# Altium schematic sheet Power input monitoring.SchDoc
size A4; SheetNumber: 18; SheetTotal: 18
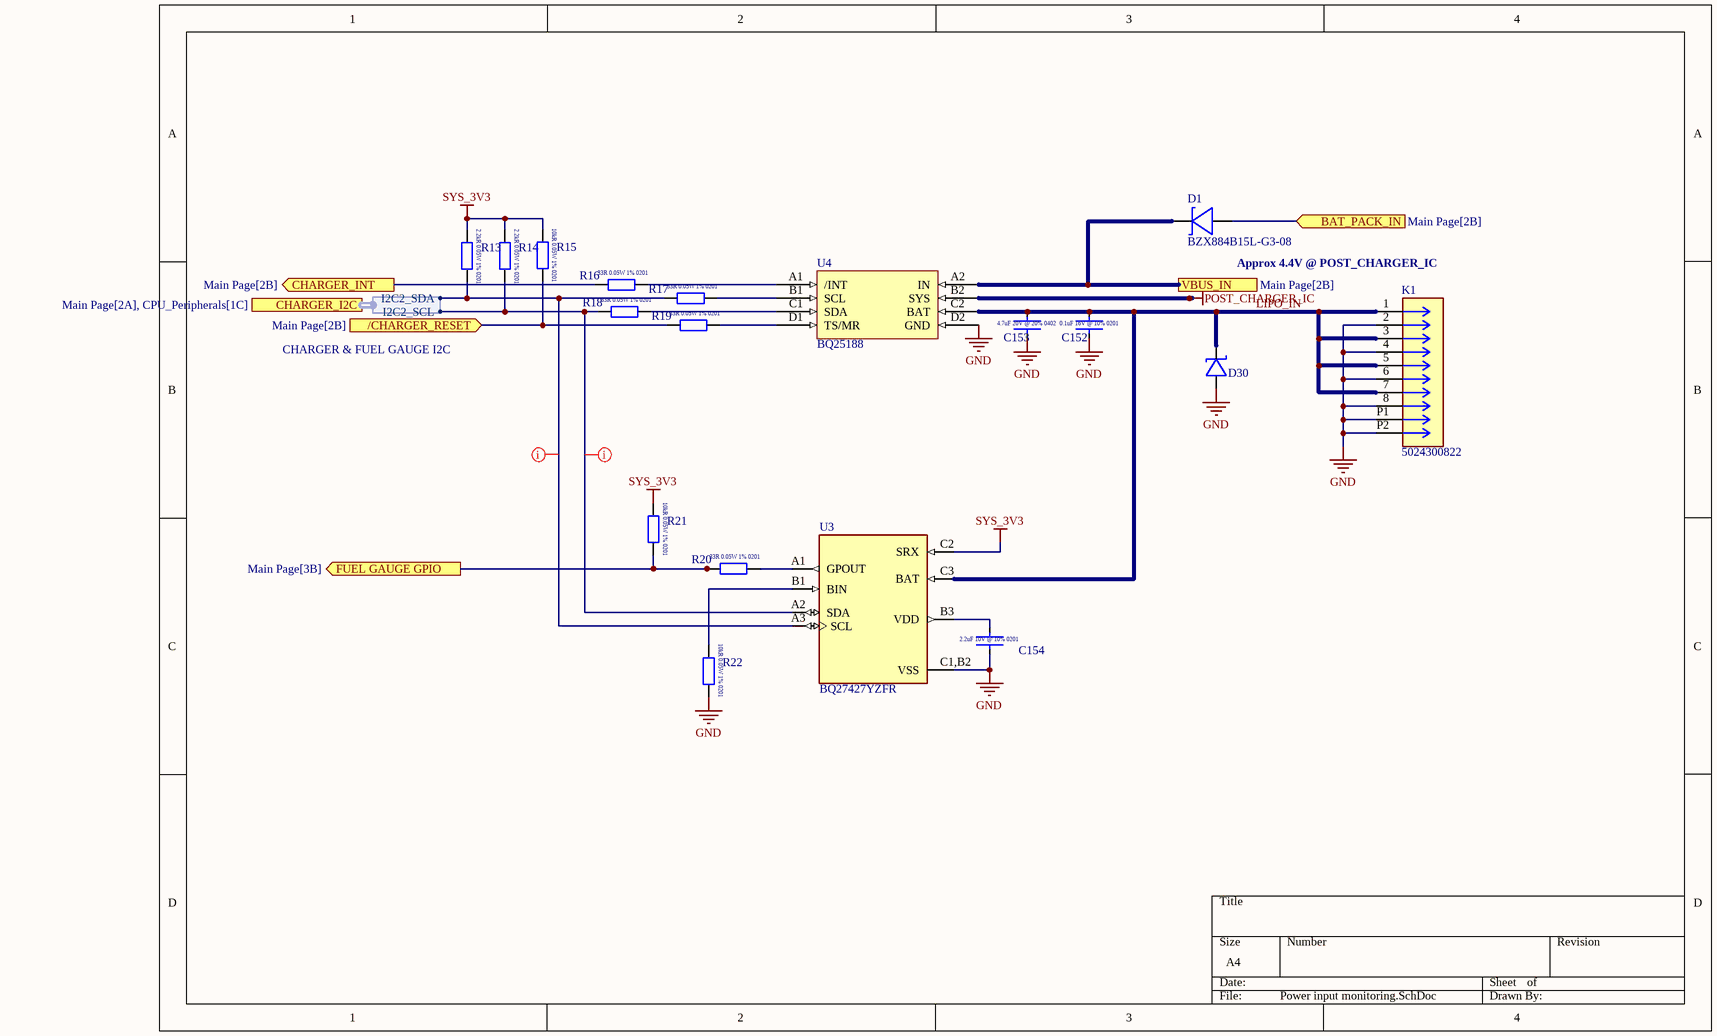
[diagram p0: Power input monitoring.SchDoc]

## Parts
C152  0.1uF  [CAPC0603X03L]  (value not drawn)
C153  4.7uF  [CAPC1005X06L]  (value not drawn)
C154  GRM033R61A225KE47D  [CAPC0603X03L]  (value not drawn)
D1  BZX884B15L-G3-08  [BZX884B15L-G3-08]
D30  RCLAMP04041PW.C  [RCLAMP04041PW.C]  (value not drawn)
K1  5024300822  [5024300822]
R13  RC0201FR-072K2L  [RESC0603X03L]  (value not drawn)
R14  RC0201FR-072K2L  [RESC0603X03L]  (value not drawn)
R15  ERJ-1GNF1002C  [RESC0603X03L]  (value not drawn)
R16  ERJ-1GNF33R0C  [RESC0603X03L]  (value not drawn)
R17  ERJ-1GNF33R0C  [RESC0603X03L]  (value not drawn)
R18  ERJ-1GNF33R0C  [RESC0603X03L]  (value not drawn)
R19  ERJ-1GNF33R0C  [RESC0603X03L]  (value not drawn)
R20  ERJ-1GNF33R0C  [RESC0603X03L]  (value not drawn)
R21  ERJ-1GNF1002C  [RESC0603X03L]  (value not drawn)
R22  ERJ-1GNF1002C  [RESC0603X03L]  (value not drawn)
U3  BQ27427YZFR  [BQ27427YZFR]
U4  BQ25188  [BQ25188]

## Ports
/CHARGER_RESET (in, see Main Page[2B]), BAT_PACK_IN (in, see Main Page[2B]), CHARGER_I2C (harness CHARGER & FUEL GAUGE I2C, see Main Page[2A], CPU_Peripherals[1C]), CHARGER_INT (out, see Main Page[2B]), FUEL GAUGE GPIO (out, see Main Page[3B]), VBUS_IN (see Main Page[2B])

## Harnesses
CHARGER & FUEL GAUGE I2C: I2C2_SCL, I2C2_SDA

## Nets
GND: C152.1 C153.1 C154.1 D30.1 K1.2 K1.4 K1.6 K1.8 K1.P1 K1.P2 R22.2 U3.C1,B2(VSS) U4.D2(GND)
POST_CHARGER_IC: U4.B2(SYS)
SYS_3V3: R13.1 R14.1 R15.1 R21.1 U3.C2(SRX)
/CHARGER_RESET: R15.2 R19.1 ; port /CHARGER_RESET
BAT_PACK_IN: D1.1(in) ; port BAT_PACK_IN
CHARGER_INT: R16.1 ; port CHARGER_INT
FUEL GAUGE GPIO: R20.1 R21.2 ; port FUEL GAUGE GPIO
LIPO_IN: C152.2 C153.2 D30.2 K1.1 K1.3 K1.5 K1.7 U3.C3(BAT) U4.C2(BAT)
VBUS_IN: D1.2(out) U4.A2(IN) ; port VBUS_IN
NetC154_2: C154.2 U3.B3(VDD)
NetR13_2: R13.2 R17.1 U3.A3(SCL)
NetR14_2: R14.2 R18.1 U3.A2(SDA) ; port CHARGER_I2C.I2C2_SCL
NetR16_2: R16.2 U4.A1(/INT)
NetR17_2: R17.2 U4.B1(SCL)
NetR18_2: R18.2 U4.C1(SDA)
NetR19_2: R19.2 U4.D1(TS/MR)
NetR20_2: R20.2 U3.A1(GPOUT)
NetR22_1: R22.1 U3.B1(BIN)

## Layout directives
net class I2C_PWR: NetR13_2, NetR14_2

## Notes on the sheet
- Approx 4.4V @ POST_CHARGER_IC
- (in symbol CL05A475MO5NUNC) 4.7uF 20V @ 20% 0402
- (in symbol ERJ-1GNF33R0C) 33R 0.05W 1% 0201
- (in symbol ERJ-1GNF1002C) 10kR 0.05W 1% 0201
- (in symbol GRM033R61A225KE47D) 2.2uF 10V @ 10% 0201
- (in symbol GRM033R61E104KE14J) 0.1uF 16V @ 10% 0201
- (in symbol RC0201FR-072K2L) 2.2kR 0.05W 1% 0201

## Library data of the parts
C152 = GRM033R61E104KE14J: 0.1 µF ±10% 25V Ceramic Capacitor X5R 0201 (0603 Metric)0.1 µF ±10% 25V Ceramic Capacitor X5R 0201 (0603 Metric); ComponentLink1Description: New link; ComponentLink1URL: https://www.digikey.com.au/en/products/detail/murata-electronics/GRM033R61E104KE14J/4904732?s=N4IgTCBcDaIOICUCyAGAzGhA2AjAURxQBYBpAogKRAF0BfIA
C153 = CL05A475MO5NUNC: 4.7 µF ±20% 16V Ceramic Capacitor X5R 0402 (1005 Metric)
C154 = GRM033R61A225KE47D: 2.2 µF ±10% 10V Ceramic Capacitor X5R 0201 (0603 Metric); ComponentLink1Description: New link; ComponentLink1URL: https://www.digikey.com.au/en/products/detail/murata-electronics/GRM033R61A225KE47D/5877390
D1 = BZX884B15L-G3-08: Zener Diode 15 V 300 mW ±2% Surface Mount DFN1006-2A; ComponentLink1Description: New link; ComponentLink1URL: https://www.digikey.com.au/en/products/detail/vishay-general-semiconductor-diodes-division/BZX884B15L-G3-08/14312748
D30 = RCLAMP04041PW.C: 8V Clamp 20A (8/20µs) Ipp Tvs Diode Surface Mount 2-DFN (1x0.6); ComponentLink1Description: New link; ComponentLink1URL: https://www.digikey.com.au/en/products/detail/semtech-corporation/RCLAMP04041PW-C/21379403
K1 = 5024300822: SlimStack Board-to-Board Plug, 0.40mm Pitch, Surface Mount, Dual Row, Vertical Stacking, 1.00mm Stacking Height, with Solder Tabs, 8 Circuits; Package: None; Price: None; Value: *; MP: 5024300822; Availability: Unavailable; ComponentLink1Description: New link; ComponentLink1URL: https://www.digikey.com.au/en/products/detail/molex/5024300822/9693806
R13 R14 = RC0201FR-072K2L: 2.2 kOhms ±1% 0.05W, 1/20W Chip Resistor 0201 (0603 Metric) Moisture Resistant Thick Film
R15 R21 R22 = ERJ-1GNF1002C: 10 kOhms ±1% 0.05W, 1/20W Chip Resistor 0201 (0603 Metric) Thick Film; ComponentLink1Description: New link; ComponentLink1URL: https://www.digikey.com.au/en/products/detail/panasonic-electronic-components/ERJ-1GNF1002C/2036226
R16-R20 = ERJ-1GNF33R0C: 33 Ohms ±1% 0.05W, 1/20W Chip Resistor 0201 (0603 Metric) Thick Film; ComponentLink1Description: New link; ComponentLink1URL: https://www.digikey.com.au/en/products/detail/panasonic-electronic-components/ERJ-1GNF33R0C/2035941
U3 = BQ27427YZFR: Single-cell battery fuel gauge with pre-programmed chemistry and integrated sense resistor; MF: Texas Instruments; SnapEDA_Link: https://www.snapeda.com/parts/BQ27427YZFR/Texas+Instruments/view-part/?ref=snap; Package: None; Value: *; MP: BQ27427YZFR; Check_prices: https://www.snapeda.com/parts/BQ27427YZFR/Texas+Instruments/view-part/?ref=eda
U4 = BQ25188: I2C, 1A single cell linear battery charger, 18V input, powerpath, ship mode and battery tracking